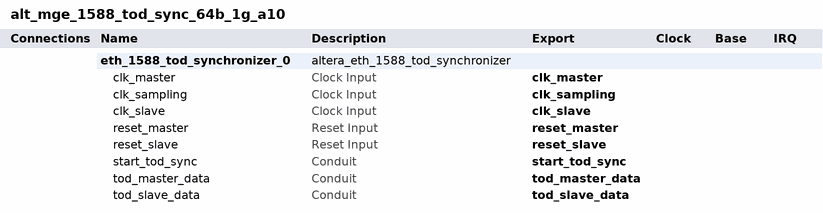
[diagram p0: system contents]
# Platform Designer (Qsys) system alt_mge_1588_tod_sync_64b_1g_a10, Arria 10 10AX115S4F45I3SG
# Parameters at their usual value, and those the tool derives, are not listed.
package require -exact qsys 15.1
create_system alt_mge_1588_tod_sync_64b_1g_a10
set_project_property DEVICE_FAMILY {Arria 10}
set_project_property DEVICE 10AX115S4F45I3SG

add_instance eth_1588_tod_synchronizer_0 altera_eth_1588_tod_synchronizer 15.1
set_instance_property eth_1588_tod_synchronizer_0 AUTO_EXPORT true
set_instance_parameter_value eth_1588_tod_synchronizer_0 PERIOD_FNSEC 26214
set_instance_parameter_value eth_1588_tod_synchronizer_0 PERIOD_NSEC 6
set_instance_parameter_value eth_1588_tod_synchronizer_0 SAMPLE_SIZE 64
set_instance_parameter_value eth_1588_tod_synchronizer_0 SYNC_MODE 13
set_instance_parameter_value eth_1588_tod_synchronizer_0 TOD_MODE 0

# exported interfaces
add_interface clk_master clock sink
set_interface_property clk_master EXPORT_OF eth_1588_tod_synchronizer_0.clk_master
add_interface clk_sampling clock sink
set_interface_property clk_sampling EXPORT_OF eth_1588_tod_synchronizer_0.clk_sampling
add_interface clk_slave clock sink
set_interface_property clk_slave EXPORT_OF eth_1588_tod_synchronizer_0.clk_slave
add_interface reset_master reset sink
set_interface_property reset_master EXPORT_OF eth_1588_tod_synchronizer_0.reset_master
add_interface reset_slave reset sink
set_interface_property reset_slave EXPORT_OF eth_1588_tod_synchronizer_0.reset_slave
add_interface start_tod_sync conduit end
set_interface_property start_tod_sync EXPORT_OF eth_1588_tod_synchronizer_0.start_tod_sync
add_interface tod_master_data conduit end
set_interface_property tod_master_data EXPORT_OF eth_1588_tod_synchronizer_0.tod_master_data
add_interface tod_slave_data conduit end
set_interface_property tod_slave_data EXPORT_OF eth_1588_tod_synchronizer_0.tod_slave_data

set_interconnect_requirement {$system} qsys_mm.clockCrossingAdapter HANDSHAKE
set_interconnect_requirement {$system} qsys_mm.enableEccProtection FALSE
set_interconnect_requirement {$system} qsys_mm.insertDefaultSlave FALSE
set_interconnect_requirement {$system} qsys_mm.maxAdditionalLatency 1

save_system alt_mge_1588_tod_sync_64b_1g_a10.qsys
